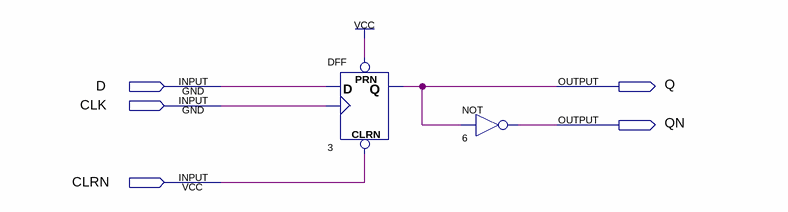
[diagram p0: schematic sheet]
// Quartus schematic D_FlipFiop.bdf as structural Verilog: 2 symbols, 5 pins
module D_FlipFiop (
  input  D,
  input  CLK,
  input  CLRN,
  output Q,
  output QN
);

  DFF u_3 (.CLRN(CLRN), .CLK(CLK), .D(D), .PRN(1'b1), .Q(Q));
  not u_6 (QN, Q);
endmodule
